# EAGLE design p3-001 (EAGLE 9.1.0)
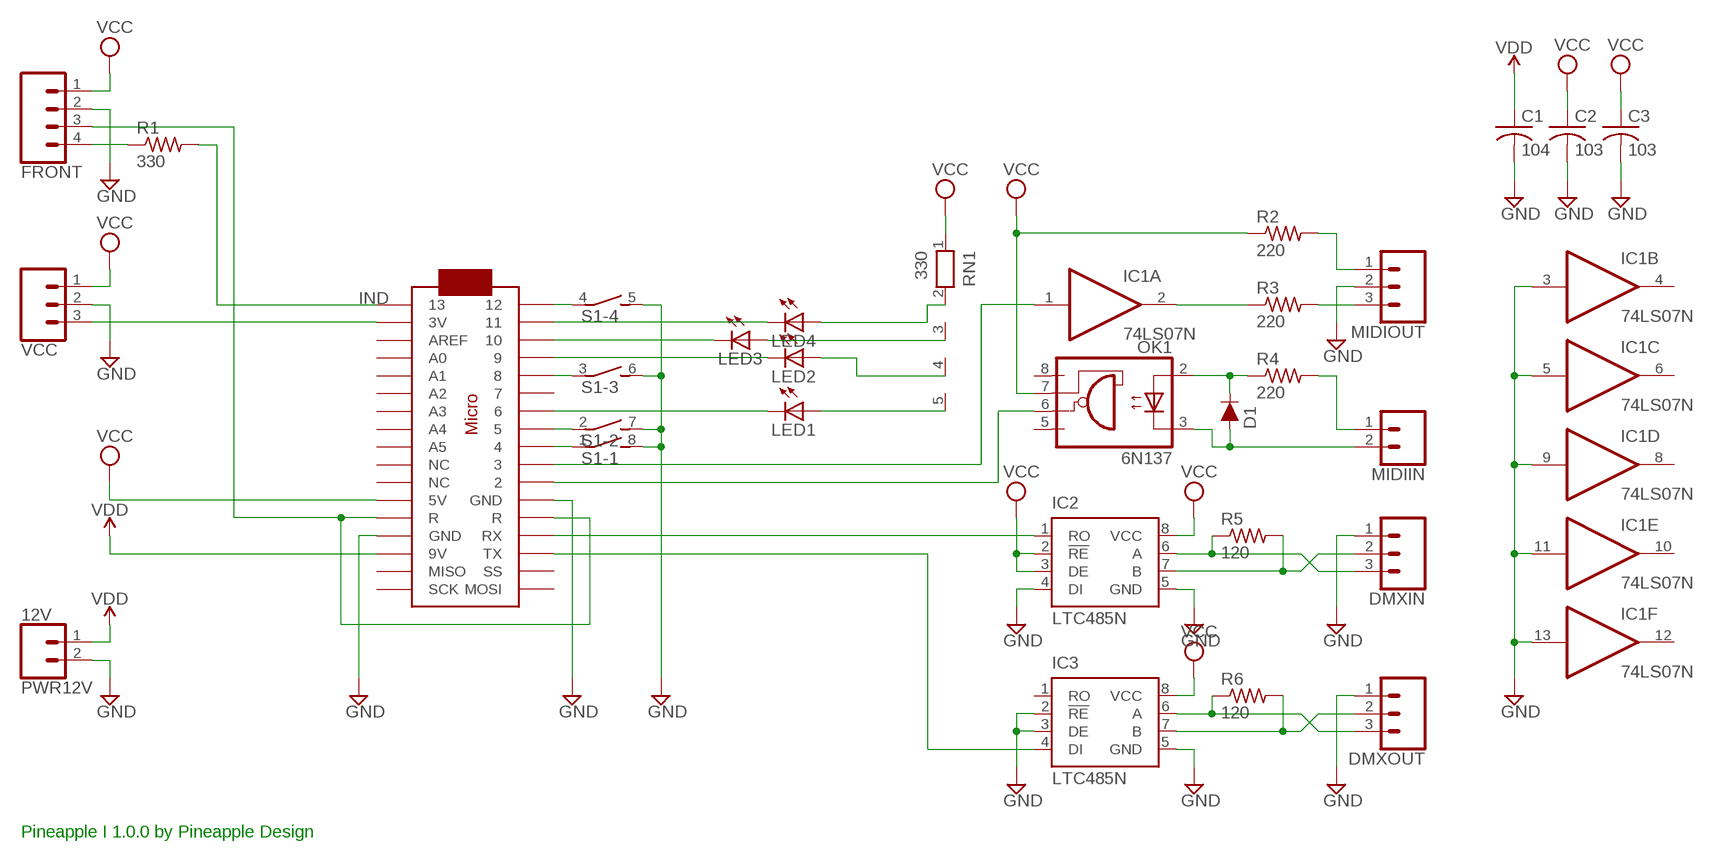
[diagram p0: schematic, sheet 1]

## Parts
C1  104  C-US025-025X050  [C025-025X050]
C2  103  C-US025-025X050  [C025-025X050]
C3  103  C-US025-025X050  [C025-025X050]
D1  DIODE-1N4148  [DIODE-1N4148]
DMXIN  CONN_03JST-PTH  [JST-3-PTH]
DMXOUT  CONN_03JST-PTH  [JST-3-PTH]
FRONT  CONN_04JST-PTH  [JST-4-PTH]
IC1  74LS07N  [DIL14]
IC2  LTC485N  [DIL08]
IC3  LTC485N  [DIL08]
LED1  LED3MM  [LED3MM]
LED2  LED3MM  [LED3MM]
LED3  LED3MM  [LED3MM]
LED4  LED3MM  [LED3MM]
MIDIIN  CONN_02JST-PTH-2  [JST-2-PTH]
MIDIOUT  CONN_03JST-PTH  [JST-3-PTH]
OK1  6N137  [DIL08]
PWR12V  12V  CONN_02JST-PTH-2  [JST-2-PTH]
R1  330  R-US_0204/5  [0204/5]
R2  220  R-US_0204/5  [0204/5]
R3  220  R-US_0204/5  [0204/5]
R4  220  R-US_0204/5  [0204/5]
R5  120  R-US_0204/5  [0204/5]
R6  120  R-US_0204/5  [0204/5]
RN1  330  RN04  [RN-5]
S1  DIP04S  [DIP04S]
U$1  ARDUINOMICRO  [ARDUINOMICRO]
VCC  CONN_03JST-PTH  [JST-3-PTH]

## Nets
GND: C1.2 C2.2 C3.2 DMXIN.1 DMXOUT.1 FRONT.2 IC1.3(B:I) IC1.5(C:I) IC1.9(D:I) IC1.11(E:I) IC1.13(F:I) IC2.4(DI) IC2.5(GND) IC3.2(!RE) IC3.3(DE) IC3.5(GND) MIDIOUT.2 PWR12V.2 S1.5 S1.6 S1.7 S1.8 U$1.P$12(GND) U$1.P$21(GND) VCC.2
IND: R1.2 U$1.P$34
MIDIIN+: MIDIIN.1 R4.2
MIDIIN-: D1.A MIDIIN.2 OK1.3(C)
MIDITHRU+: MIDIOUT.1 R2.2
MIDITHRU-: MIDIOUT.3 R3.2
N$1: DMXIN.3 IC2.6(A) R5.1
N$2: IC1.2(A:O) R3.1
N$3: FRONT.4 R1.1
N$4: DMXIN.2 IC2.7(B) R5.2
N$5: D1.C OK1.2(A) R4.1
N$6: IC1.1(A:I) U$1.P$10
N$7: IC3.4(DI) U$1.P$15(TX)
N$8: DMXOUT.3 IC3.6(A) R6.1
N$9: DMXOUT.2 IC3.7(B) R6.2
N$10: IC2.1(RO) U$1.P$14(RX)
N$11: LED1.K(C) U$1.P$7
N$12: LED2.K(C) U$1.P$4
N$13: LED3.K(C) U$1.P$3
N$14: LED4.K(C) U$1.P$2
N$15: LED1.A RN1.5
N$16: LED2.A RN1.4
N$17: LED3.A RN1.3
N$18: LED4.A RN1.2
N$19: S1.1 U$1.P$9
N$20: S1.2 U$1.P$8
N$21: S1.3 U$1.P$5
N$22: S1.4 U$1.P$1
RST: FRONT.3 U$1.P$13(R) U$1.P$22(R)
RX: OK1.6(VO) U$1.P$11
V3V: U$1.P$33(3V) VCC.3
VCC: C2.1 C3.1 FRONT.1 IC2.2(!RE) IC2.3(DE) IC2.8(VCC) IC3.8(VCC) OK1.7(VE) R2.1 RN1.1 U$1.P$23(5V) VCC.1
VDD: C1.1 PWR12V.1 U$1.P$20(9V)
Unconnected: IC1.4(B:O) IC1.6(C:O) IC1.8(D:O) IC1.10(E:O) IC1.12(F:O) IC3.1(RO) OK1.5(GND) OK1.8(VCC) U$1.P$6 U$1.P$16(SS) U$1.P$17(MOSI) U$1.P$18(SCK) U$1.P$19(MISO) U$1.P$24(NC) U$1.P$25(NC) U$1.P$26(A5) U$1.P$27(A4) U$1.P$28(A3) U$1.P$29(A2) U$1.P$30(A1) U$1.P$31(A0) U$1.P$32(AREF)

## Notes on the sheet
- Pineapple I 1.0.0 by Pineapple Design

## Power pins joined to a net without a drawn wire
GND: IC1.7(P:GND)
VCC: IC1.14(P:VCC)

## Library data of the parts
C1-C3 = rcl:C-US: CAPACITOR, American symbol; SPICEPREFIX: C
D1 = SparkFun-DiscreteSemi:DIODE: Diode These are standard reverse protection diodes and small signal diodes. SparkFun Products: SparkFun SparkPunk Sound Kit <https://www.sparkfun.com/products/11177> SparkFun ESP8266 Thing <https://www.sparkfun.com/products/13231>; PROD_ID: DIO-08378; VALUE: 200mA/100V/1V
DMXIN DMXOUT MIDIOUT VCC = SparkFun-Connectors:CONN_03: Multi connection point. Often used as Generic Header-pin footprint for 0.1 inch spaced/style header connections On any of the 0.1 inch spaced packages, you can populate with these: Break Away Headers - Straight <https://www.sparkfun.com/products/116> (PRT-00116) Break Away Male Headers - Right Angle <https://www.sparkfun.com/products/553> (PRT-00553) Female Headers <https://www.sparkfun.com/products/115> (PRT-00115) Break Away Headers - Machine Pin <https://www.sparkfun.com/products/117> (PRT-00117) Break Away Female Headers - Swiss Machine Pin <https://www.sparkfun.com/products/743> (PRT-00743) Stackable Header - 3 Pin (Female, 0.1") <https://www.sparkfun.com/products/13875> (PRT-13875) For SCREWTERMINALS and SPRING TERMINALS visit here: Screw Terimnals on SparkFun.com <https://www.sparkfun.com/search/results?term=Screw+Terminals> (5mm/3.5mm/2.54mm spacing) This device is also useful as a general connection point to wire up your design to another part of your project. Our various solder wires solder well into these plated through hole pads. Hook-Up Wire - Assortment (Stranded, 22 AWG) <https://www.sparkfun.com/products/11375> (PRT-11375) Hook-Up Wire - Assortment (Solid Core, 22 AWG) <https://www.sparkfun.com/products/11367> (PRT-11367) View the entire wire category on our website here <https://www.sparkfun.com/categories/141> Special notes: Molex polarized connector foot print use with SKU : PRT-08232 with associated crimp pins and housings.; PROD_ID: WIRE-10037; SF_ID: PRT-09915
FRONT = SparkFun-Connectors:CONN_04: Multi connection point. Often used as Generic Header-pin footprint for 0.1 inch spaced/style header connections On any of the 0.1 inch spaced packages, you can populate with these: Break Away Headers - Straight <https://www.sparkfun.com/products/116> (PRT-00116) Break Away Male Headers - Right Angle <https://www.sparkfun.com/products/553> (PRT-00553) Female Headers <https://www.sparkfun.com/products/115> (PRT-00115) Break Away Headers - Machine Pin <https://www.sparkfun.com/products/117> (PRT-00117) Break Away Female Headers - Swiss Machine Pin <https://www.sparkfun.com/products/743> (PRT-00743) For SCREWTERMINALS and SPRING TERMINALS visit here: Screw Terimnals on SparkFun.com <https://www.sparkfun.com/search/results?term=Screw+Terminals> (5mm/3.5mm/2.54mm spacing) This device is also useful as a general connection point to wire up your design to another part of your project. Our various solder wires solder well into these plated through hole pads. Hook-Up Wire - Assortment (Stranded, 22 AWG) <https://www.sparkfun.com/products/11375> (PRT-11375) Hook-Up Wire - Assortment (Solid Core, 22 AWG) <https://www.sparkfun.com/products/11367> (PRT-11367) View the entire wire category on our website here <https://www.sparkfun.com/categories/141> Special notes: Molex polarized connector foot print use with SKU : PRT-08231 with associated crimp pins and housings. 1MM SMD Version SKU: PRT-10208; PROD_ID: WIRE-13531; SF_ID: PRT-09916
IC1 = 74xx-us:74*07: Hex BUFFER, open collector high-voltage output
IC2 IC3 = linear-technology:LTC485: Low Power RS485 Interface Transceiver Source: http://www.linear.com/pc/downloadDocument.do?navId=H0,C1,C1007,C1017,P2064,D1718; OC_FARNELL: unknown; OC_NEWARK: unknown
LED1-LED4 = led:LED: LED OSRAM: - CHIPLED LG R971, LG N971, LY N971, LG Q971, LY Q971, LO R971, LY R971 LH N974, LH R974 LS Q976, LO Q976, LY Q976 LO Q996 - Hyper CHIPLED LW Q18S LB Q993, LB Q99A, LB R99A - SideLED LS A670, LO A670, LY A670, LG A670, LP A670 LB A673, LV A673, LT A673, LW A673 LH A674 LY A675 LS A676, LA A676, LO A676, LY A676, LW A676 LS A679, LY A679, LG A679 - Hyper Micro SIDELED® LS Y876, LA Y876, LO Y876, LY Y876 LT Y87S - SmartLED LW L88C, LW L88S LB L89C, LB L89S, LG L890 LS L89K, LO L89K, LY L89K LS L896, LA L896, LO L896, LY L896 - TOPLED LS T670, LO T670, LY T670, LG T670, LP T670 LSG T670, LSP T670, LSY T670, LOP T670, LYG T670 LG T671, LOG T671, LSG T671 LB T673, LV T673, LT T673, LW T673 LH T674 LS T676, LA T676, LO T676, LY T676, LB T676, LH T676, LSB T676, LW T676 LB T67C, LV T67C, LT T67C, LS T67K, LO T67K, LY T67K, LW E67C LS E67B, LA E67B, LO E67B, LY E67B, LB E67C, LV E67C, LT E67C LW T67C LS T679, LY T679, LG T679 LS T770, LO T770, LY T770, LG T770, LP T770 LB T773, LV T773, LT T773, LW T773 LH T774 LS E675, LA E675, LY E675, LS T675 LS T776, LA T776, LO T776, LY T776, LB T776 LHGB T686 LT T68C, LB T68C - Hyper Mini TOPLED® LB M676 - Mini TOPLED Santana® LG M470 LS M47K, LO M47K, LY M47K Source: http://www.osram.convergy.de LUXEON: - LUMILED® LXK2-PW12-R00, LXK2-PW12-S00, LXK2-PW14-U00, LXK2-PW14-V00 LXK2-PM12-R00, LXK2-PM12-S00, LXK2-PM14-U00 LXK2-PE12-Q00, LXK2-PE12-R00, LXK2-PE12-S00, LXK2-PE14-T00, LXK2-PE14-U00 LXK2-PB12-K00, LXK2-PB12-L00, LXK2-PB12-M00, LXK2-PB14-N00, LXK2-PB14-P00, LXK2-PB14-Q00 LXK2-PR12-L00, LXK2-PR12-M00, LXK2-PR14-Q00, LXK2-PR14-R00 LXK2-PD12-Q00, LXK2-PD12-R00, LXK2-PD12-S00 LXK2-PH12-R00, LXK2-PH12-S00 LXK2-PL12-P00, LXK2-PL12-Q00, LXK2-PL12-R00 Source: www.luxeon.com KINGBRIGHT: KA-3528ASYC Source: www.kingbright.com
MIDIIN PWR12V = SparkFun-Connectors:CONN_02: Multi connection point. Often used as Generic Header-pin footprint for 0.1 inch spaced/style header connections On any of the 0.1 inch spaced packages, you can populate with these: Break Away Headers - Straight <https://www.sparkfun.com/products/116> (PRT-00116) Break Away Male Headers - Right Angle <https://www.sparkfun.com/products/553> (PRT-00553) Female Headers <https://www.sparkfun.com/products/115> (PRT-00115) Break Away Headers - Machine Pin <https://www.sparkfun.com/products/117> (PRT-00117) Break Away Female Headers - Swiss Machine Pin <https://www.sparkfun.com/products/743> (PRT-00743) For SCREWTERMINALS and SPRING TERMINALS visit here: Screw Terimnals on SparkFun.com <https://www.sparkfun.com/search/results?term=Screw+Terminals> (5mm/3.5mm/2.54mm spacing) This device is also useful as a general connection point to wire up your design to another part of your project. Our various solder wires solder well into these plated through hole pads. Hook-Up Wire - Assortment (Stranded, 22 AWG) <https://www.sparkfun.com/products/11375> (PRT-11375) Hook-Up Wire - Assortment (Solid Core, 22 AWG) <https://www.sparkfun.com/products/11367> (PRT-11367) View the entire wire category on our website here <https://www.sparkfun.com/categories/141> Special notes: Molex polarized connector foot print use with: PRT-08233 with associated crimp pins and housings. 2.54_SCREWTERM for use with PRT-10571. 3.5mm Screw Terminal footprints for PRT-08084 5mm Screw Terminal footprints for use with PRT-08432; PROD_ID: CONN-09863; SKU: PRT-09914
OK1 = optocoupler:6N137: MOTOROLA OPTO COUPLER; MPN: 6N137; OC_FARNELL: 1328376; OC_NEWARK: 52M1895
R1-R6 = resistor:R-US_: RESISTOR, American symbol
RN1 = resistor-net:RN04: RESISTOR NETWORK; OC_FARNELL: unknown; OC_NEWARK: unknown
S1 = switch-dil:DIP04S: DIL/CODE SWITCH; OC_FARNELL: unknown; OC_NEWARK: unknown
U$1 = adafruit:ARDUINOMICRO

## Net classes
0 default: width 0.254 mm, drill 0.254 mm, clearance 0.254 mm

## Board
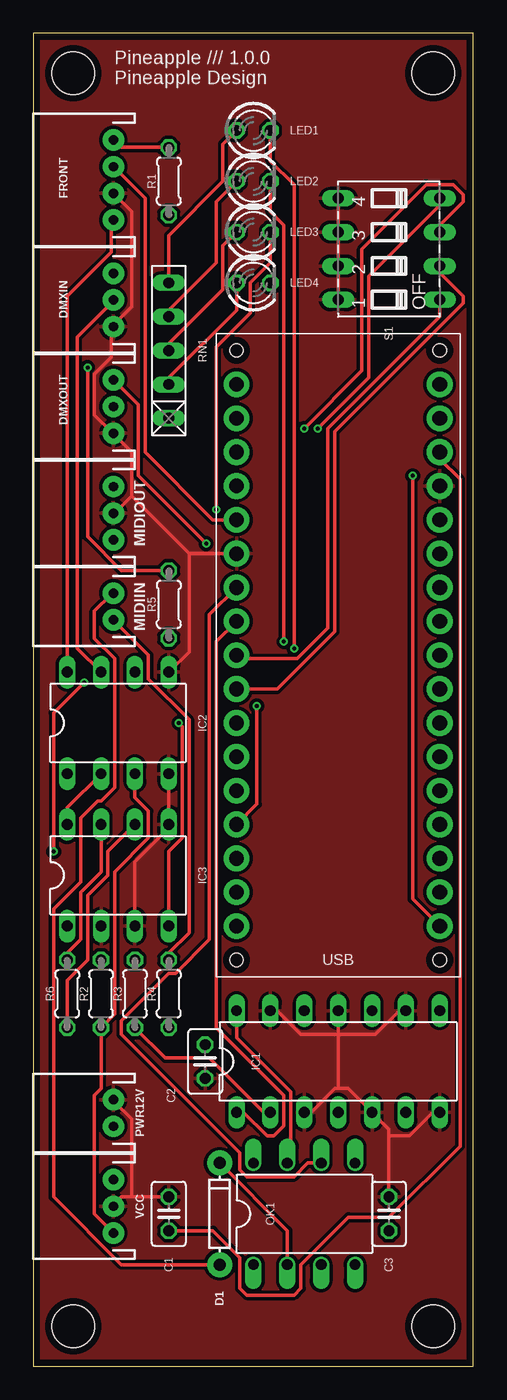
[diagram p1: board, top side]
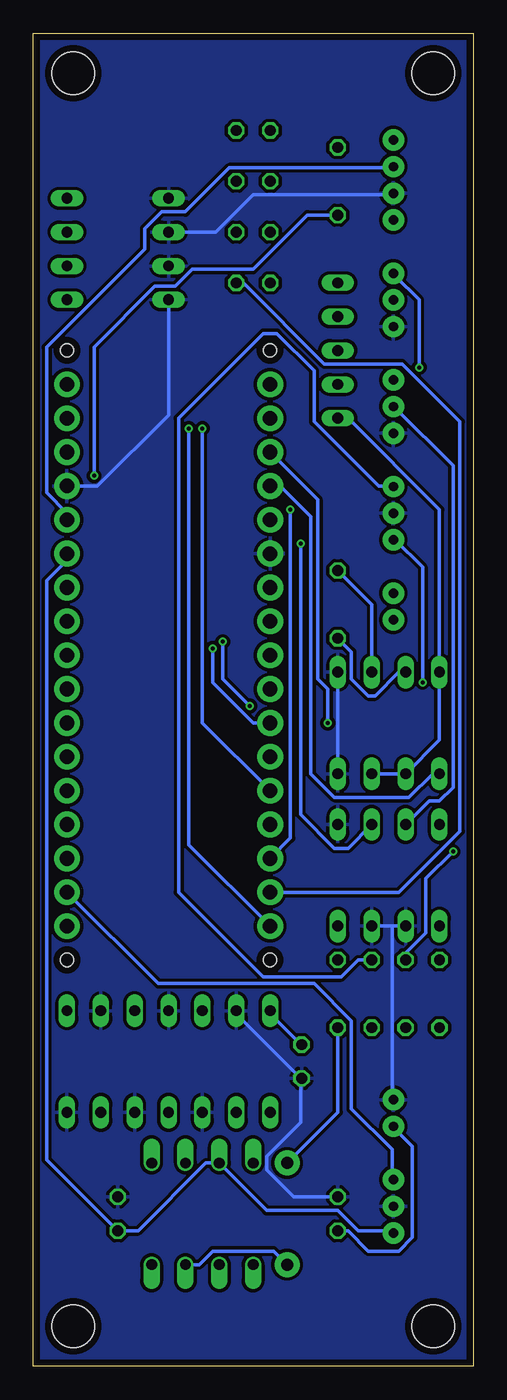
[diagram p2: board, bottom side, seen from below]

Size 33 x 100 mm. Coordinates in mm from the lower left corner, seen from the top.
Outline: 0,0 33,0 33,100 0,100 0,0
Copper layers (1*16): Top 0.035mm / dielectric 1.53mm / Bottom 0.035mm
Design rules "pban_5mil-l2": minimum track width 5mil, minimum drill 0.3mm, track to track 5mil, track to pad 0.229mm, pad to pad 5mil, via to via 5mil, smd to smd 5mil, copper to edge 0.5mm, drill to drill 0.5mm, minimum pad ring 0.15mm, minimum via ring 0.15mm, stop-mask expansion 4mil, vias tented up to drill 0.35mm, thermal gap 10mil
Holes 3.2 mm at 3,3 30,3 30,97 3,97
Holes 1 mm at 15.24,30.48 30.48,30.48 15.24,76.2 30.48,76.2

### Footprints (pad centres in the part's own frame; a part is rotated, then mirrored left to right if it is on the bottom)
C025-025X050 = drill 0.813 octagon: 1 -1.27,0; 2 1.27,0
DIODE-1N4148 = drill 0.9 pad 1.88: A -3.81,0; C 3.81,0
JST-3-PTH = drill 0.7 pad 1.6: 1 -2,0; 2 0,0; 3 2,0
JST-4-PTH = drill 0.7 pad 1.6: 1 -3,0; 2 -1,0; 3 1,0; 4 3,0
DIL14 = drill 0.813 long: 1 -7.62,-3.81; 2 -5.08,-3.81; 3 -2.54,-3.81; 4 0,-3.81; 5 2.54,-3.81; 6 5.08,-3.81; 7 7.62,-3.81; 8 7.62,3.81; 9 5.08,3.81; 10 2.54,3.81; 11 0,3.81; 12 -2.54,3.81; 13 -5.08,3.81; 14 -7.62,3.81
DIL08 = drill 0.813 long: 1 -3.81,-3.81; 2 -1.27,-3.81; 3 1.27,-3.81; 4 3.81,-3.81; 5 3.81,3.81; 6 1.27,3.81; 7 -1.27,3.81; 8 -3.81,3.81
LED3MM = drill 0.813 octagon: A -1.27,0; K 1.27,0
JST-2-PTH = drill 0.7 pad 1.6: 1 -1,0; 2 1,0
DIL08' = drill 0.813 offset: 1 -3.81,-3.81; 2 -1.27,-3.81; 3 1.27,-3.81; 4 3.81,-3.81; 5 3.81,3.81; 6 1.27,3.81; 7 -1.27,3.81; 8 -3.81,3.81
0204/5 = drill 0.813 octagon: 1 -2.54,0; 2 2.54,0
RN-5 = drill 0.813 long: 1 -5.08,0; 2 -2.54,0; 3 0,0; 4 2.54,0; 5 5.08,0
DIP04S = drill 0.813 long: 1 -3.81,-3.81; 2 -1.27,-3.81; 3 1.27,-3.81; 4 3.81,-3.81; 5 3.81,3.81; 6 1.27,3.81; 7 -1.27,3.81; 8 -3.81,3.81
ARDUINOMICRO = drill 1.1 pad 1.93: P$1 -20.32,7.62; P$2 -17.78,7.62; P$3 -15.24,7.62; P$4 -12.7,7.62; P$5 -10.16,7.62; P$6 -7.62,7.62; P$7 -5.08,7.62; P$8 -2.54,7.62; P$9 0,7.62; P$10 2.54,7.62; P$11 5.08,7.62; P$12 12.7,-7.62; P$13 10.16,-7.62; P$14 12.7,7.62; P$15 15.24,7.62; P$16 17.78,7.62; P$17 20.32,7.62; P$18 20.32,-7.62; P$19 17.78,-7.62; P$20 15.24,-7.62; P$21 7.62,7.62; P$22 10.16,7.62; P$23 7.62,-7.62; P$24 5.08,-7.62; P$25 2.54,-7.62; P$26 0,-7.62; P$27 -2.54,-7.62; P$28 -5.08,-7.62; P$29 -7.62,-7.62; P$30 -10.16,-7.62; P$31 -12.7,-7.62; P$32 -15.24,-7.62; P$33 -17.78,-7.62; P$34 -20.32,-7.62

### Placement (x,y rotation side)
C1  10.16,11.43 90 top
C2  12.88,22.86 270 top
C3  26.67,11.43 90 top
D1  13.97,11.43 90 top
DMXIN  6,80 90 top
DMXOUT  6,72 90 top
FRONT  6,89 90 top
IC1  22.86,22.86 0 top
IC2  6.35,48.26 0 top
IC3  6.35,36.83 0 top
LED1  16.51,92.71 0 top
LED2  16.51,88.9 0 top
LED3  16.51,85.09 0 top
LED4  16.51,81.28 0 top
MIDIIN  6,57 90 top
MIDIOUT  6,64 90 top
OK1  6N137  [DIL08']  20.32,11.43 0 top
PWR12V  6,19 90 top
R1  10.16,88.9 270 top
R2  5.08,27.94 90 top
R3  7.62,27.94 90 top
R4  10.16,27.94 90 top
R5  10.16,57.15 270 top
R6  2.54,27.94 90 top
RN1  10.16,76.2 90 top
S1  26.67,83.82 90 top
U$1  22.86,53.34 90 top
VCC  6,12 90 top

### Tracks (layer width: path | path; a pad name or v marks a point on that pad's centre or on a via)
GND
  Top 0.254: S1.8 S1.7 S1.6 S1.5 | 7.37,65.28 6.1,64.01 MIDIOUT.2 | 7.37,65.28 7.37,68.58 6.1,69.85 DMXOUT.1 5.84,70.1 4.57,71.37 4.57,74.42 5.84,75.69 5.84,77.98 DMXIN.1 6.1,78.23 7.37,79.5 7.37,86.61 6.1,87.88 FRONT.2 | 11.68,60.96 U$1.P$21 | 7.37,65.28 11.68,60.96 | IC1.3 20.83,19.05 22.61,20.83 22.86,20.83 | 22.86,20.83 23.62,20.83 IC1.5 26.67,17.78 26.67,17.27 | 22.86,20.83 22.86,24.89 | 22.86,24.89 IC1.11 | 26.67,17.27 C3.2 | IC1.7 29.97,19.05 28.19,17.27 26.67,17.27 | IC1.9 27.43,26.67 25.65,24.89 22.86,24.89 | IC1.13 18.29,26.67 20.07,24.89 22.86,24.89 | 7.37,12.7 6.6,12.7 6.1,12.19 VCC.2 | 7.37,12.7 C1.2 | 7.37,12.7 7.37,18.54 6.1,19.81 PWR12V.2 | IC2.4 IC3.5 10.16,40.39 7.62,37.85 IC3.3 | 11.68,60.96 11.68,53.59 IC2.5
  Bottom 0.254: U$1.P$12 28.19,66.04 22.86,71.37 S1.8 | S1.6 19.3,85.09 16.51,87.88 6.1,87.88 FRONT.2 | 12.95,21.59 17.78,26.42 IC1.13 | 12.95,21.59 C2.2 12.95,21.59 | IC3.3 6.1,33.02 | 6.1,33.02 IC3.2 | IC2.4 IC2.5 | 6.1,33.02 6.1,20.07 PWR12V.2 | 12.95,21.59 12.95,18.29 15.49,15.75 15.49,14.73 13.46,12.7 C1.2
  pour Top: 0,0 33,0 33,100 0,100
  pour Bottom: 0,0 33,0 33,100 0,100
IND  (via drill 0.3)
  Top 0.254: v28.45,66.8 28.45,35.05 U$1.P$34
  Bottom 0.254: R1.2 12.45,86.36 16.51,82.3 21.08,82.3 22.35,81.03 23.88,81.03 28.45,76.45 v28.45,66.8
MIDIIN+
  Top 0.254: R4.2 10.16,30.99 11.68,32.51 11.68,48.51 8.64,51.56 8.64,53.34 6.1,55.88 MIDIIN.1
MIDIIN-
  Top 0.254: D1.A 6.6,7.62 1.52,12.7 1.52,34.29 3.56,36.32 3.56,41.15 4.83,42.42 5.08,42.42 6.1,43.43 6.1,53.09 4.57,54.61 4.57,56.64 5.84,57.91 MIDIIN.2
  Bottom 0.254: OK1.3 20.57,7.62 19.56,8.64 14.99,8.64 D1.A
MIDITHRU+  (via drill 0.3)
  Top 0.254: v1.52,38.61 1.52,49.02 v3.81,51.31
  Bottom 0.254: R2.2 5.08,30.99 3.56,32.51 3.56,36.58 v1.52,38.61 | v3.81,51.31 3.81,59.94 5.84,61.98 MIDIOUT.1
MIDITHRU-
  Bottom 0.254: R3.2 8.64,30.48 9.91,29.21 15.75,29.21 22.1,35.56 22.1,71.12 15.75,77.47 14.73,77.47 11.94,74.68 11.94,70.87 7.11,66.04 6.1,66.04 MIDIOUT.3
N$1  (via drill 0.3)
  Top 0.254: v4.06,74.93 4.06,62.23 6.6,59.69 R5.1
  Bottom 0.254: IC2.6 7.62,57.15 R5.1 | v4.06,74.93 4.06,80.01 5.84,81.79 DMXIN.3
N$2
  Top 0.254: IC1.2 17.27,19.05 13.21,23.11 9.91,23.11 R3.1
N$3
  Top 0.254: R1.1 6.6,91.44 6.1,91.95 FRONT.4
N$4
  Top 0.254: IC2.7 3.3,53.85 3.3,77.22 5.84,79.76 DMXIN.2
  Bottom 0.254: IC2.7 5.59,52.07 7.37,50.29 7.87,50.29 9.14,51.56 9.14,53.59 R5.2
N$5
  Top 0.254: OK1.2 19.05,10.16 D1.C
  Bottom 0.254: R4.1 10.16,19.05 D1.C
N$6
  Top 0.254: IC1.1 15.75,19.05 17.53,17.27 18.03,17.27 18.8,18.03 18.8,20.32 13.72,25.4 13.72,54.36 U$1.P$10
N$7  (via drill 0.3)
  Top 0.254: IC3.4 10.16,38.61 11.18,39.62 11.18,48.01 v10.92,48.26
  Bottom 0.254: v10.92,48.26 10.92,50.8 11.68,51.56 11.68,65.02 U$1.P$15
N$8  (via drill 0.3)
  Top 0.254: R6.1 2.54,28.96 4.06,30.48 4.06,35.31 5.59,36.83 5.59,38.61 IC3.6 | v12.95,61.72 7.87,66.8 7.87,72.14 6.1,73.91 DMXOUT.3
  Bottom 0.254: v12.95,61.72 12.95,41.4 10.41,38.86 9.4,38.86 IC3.6
N$9
  Top 0.254: R6.2 2.54,30.99 3.56,32 3.56,35.56 5.08,37.08 IC3.7
  Bottom 0.254: IC3.7 3.3,42.42 2.54,42.42 1.52,43.43 1.52,67.56 5.84,71.88 DMXOUT.2
N$10
  Bottom 0.254: IC2.1 3.05,44.45 4.83,42.67 10.41,42.67 12.19,44.45 12.19,63.75 14.48,66.04 U$1.P$14
N$11  (via drill 0.3)
  Top 0.254: LED1.K 17.78,90.42 19.56,88.65 v19.56,53.85
  Bottom 0.254: v19.56,53.85 19.56,51.31 16.51,48.26 U$1.P$7
N$12  (via drill 0.3)
  Top 0.254: LED2.K 17.78,86.61 18.8,85.6 v18.8,54.36 | v16.76,49.53 16.76,42.16 U$1.P$4
  Bottom 0.254: v18.8,54.36 18.8,51.56 v16.76,49.53
N$13  (via drill 0.3)
  Top 0.254: LED3.K 17.78,82.8 16.26,81.28 16.26,78.99 13.72,76.45 v13.72,64.26
  Bottom 0.254: v13.72,64.26 13.72,39.62 U$1.P$3
N$14
  Bottom 0.254: LED4.K 17.27,81.28 11.18,75.18 5.33,75.18 1.02,70.87 1.02,40.13 5.59,35.56 U$1.P$2
N$15
  Top 0.254: RN1.5 10.16,84.84 14.22,88.9 14.22,91.69 LED1.A
N$16
  Top 0.254: RN1.4 10.16,79.25 13.72,82.8 13.72,87.38 LED2.A
N$17
  Top 0.254: RN1.3 10.16,76.71 14.22,80.77 14.22,84.07 LED3.A
N$18
  Top 0.254: RN1.2 10.16,74.17 15.24,79.25 LED4.A
N$19
  Top 0.254: S1.1 30.48,78.74 22.1,70.36 22.1,55.37 19.81,53.09 15.49,53.09 U$1.P$9
N$20
  Top 0.254: S1.2 30.48,82.04 32.26,80.26 32.26,79.76 22.61,70.1 22.61,55.12 18.29,50.8 U$1.P$8
N$21  (via drill 0.3)
  Top 0.254: S1.3 30.48,85.6 32.26,87.38 32.26,87.88 31.5,88.65 29.46,88.65 24.64,83.82 24.64,74.68 v20.32,70.36
  Bottom 0.254: v20.32,70.36 20.32,48.26 U$1.P$5
N$22  (via drill 0.3)
  Top 0.254: S1.4 30.48,87.12 25.15,81.79 25.15,74.17 v21.34,70.36
  Bottom 0.254: v21.34,70.36 21.34,39.12 U$1.P$1
RST
  Top 0.254: U$1.P$22 13.46,63.5 8.38,68.58 8.38,87.63 6.1,89.92 FRONT.3
  Bottom 0.254: U$1.P$13 30.48,64.01 32,65.53 32,76.45 24.64,83.82 24.64,85.34 23.37,86.61 21.59,86.61 18.29,89.92 6.1,89.92 FRONT.3
RX
  Top 0.254: OK1.6 20.57,15.24 19.56,14.22 16,14.22 15.49,14.73 15.49,16 6.6,24.89 6.6,25.91 10.16,29.46 10.67,29.46 13.21,32 13.21,56.39 U$1.P$11
V3V
  Bottom 0.254: U$1.P$33 23.62,28.7 11.94,28.7 9.14,25.91 9.14,19.3 6.1,16.26 6.1,14.22 VCC.3
VCC
  Top 0.254: IC3.8 2.54,41.91 IC2.2 | IC2.8 2.54,80.26 5.84,83.57 5.84,85.85 FRONT.1 | VCC.1 5.84,10.16 4.57,11.43 4.57,20.32 5.08,20.83 R2.1 6.1,26.42 6.1,37.08 8.64,39.62 8.64,41.66 7.62,42.67 IC2.3 | IC1.14 15.24,24.64 19.3,20.57 19.3,15.49 OK1.7
  Bottom 0.254: IC2.3 IC2.2 2.54,46.99 IC2.8 2.54,64.26 9.4,71.12 RN1.1 | IC1.14 15.24,26.42 12.95,24.13 C2.1 | U$1.P$23 30.48,60.45 32,58.93 32,15.49 C3.1 25.15,10.16 20.07,15.24 OK1.7 15.49,11.68 10.16,11.68 8.64,10.16 6.1,10.16 VCC.1
VDD
  Top 0.254: U$1.P$20 30.48,68.07 32,66.55 32,16.51 26.67,11.18 23.62,11.18 20.07,7.62 20.07,5.84 19.56,5.33 16,5.33 15.49,5.84 15.49,8.13 13.46,10.16 C1.1
  Bottom 0.254: C1.1 9.4,10.16 7.87,8.64 5.59,8.64 4.57,9.65 4.57,16.51 5.84,17.78 PWR12V.1

### Text on the board
tNames: Pineapple /// 1.0.0 / Pineapple Design | USB